# Altium schematic sheet Top Level.SchDoc
size A3; SheetNumber: 1; SheetTotal: 10
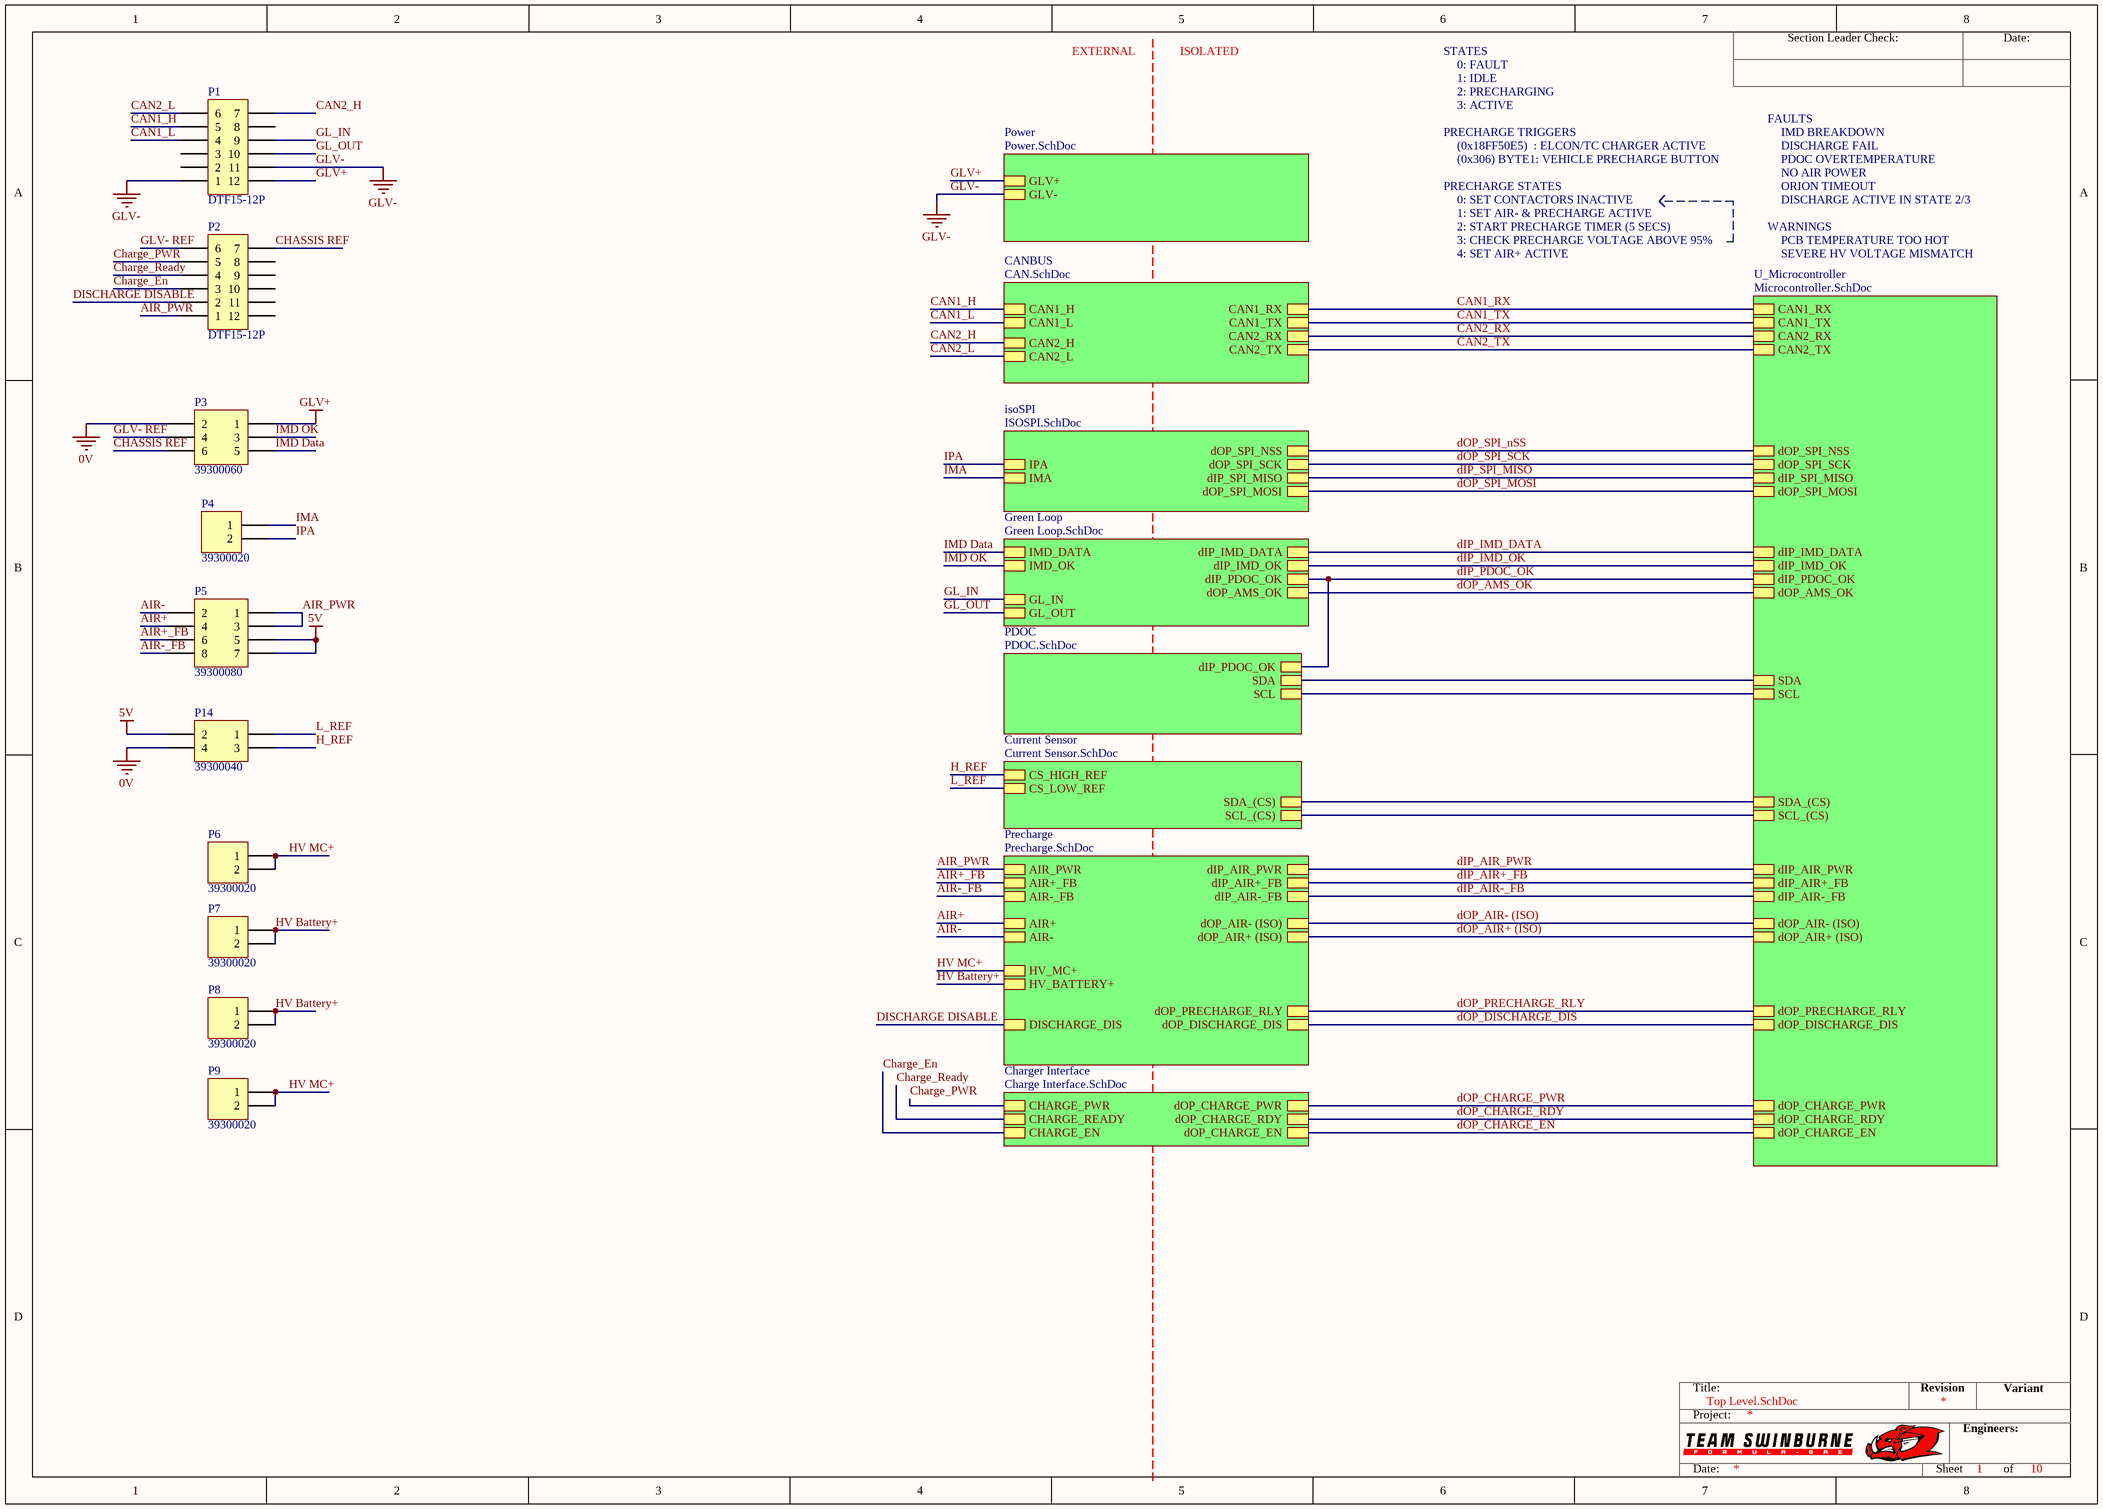
[diagram p0: Top Level.SchDoc]

## Parts
P1  DTF15-12P  [DTF15-12P]
P2  DTF15-12P  [DTF15-12P]
P3  39300060  [39300060]
P4  39300020  [39300020]
P5  39300080  [39300080]
P6  39300020  [39300020]
P7  39300020  [39300020]
P8  39300020  [39300020]
P9  39300020  [39300020]
P14  39300040  [39300040]

## Sub-sheets
CANBUS = CAN.SchDoc: CAN1_RX, CAN1_TX, CAN2_RX, CAN2_TX, CAN1_H, CAN1_L, CAN2_H, CAN2_L
Charger Interface = Charge Interface.SchDoc: dOP_CHARGE_PWR, dOP_CHARGE_RDY, dOP_CHARGE_EN, CHARGE_PWR, CHARGE_READY, CHARGE_EN
Current Sensor = Current Sensor.SchDoc: SCL_(CS), CS_HIGH_REF, CS_LOW_REF, SDA_(CS)
Green Loop = Green Loop.SchDoc: dIP_IMD_DATA, dIP_IMD_OK, dIP_PDOC_OK, dOP_AMS_OK, IMD_DATA, IMD_OK, GL_IN, GL_OUT
isoSPI = ISOSPI.SchDoc: dOP_SPI_NSS, dOP_SPI_SCK, dIP_SPI_MISO, dOP_SPI_MOSI, IPA, IMA
PDOC = PDOC.SchDoc: dIP_PDOC_OK, SDA, SCL
Power = Power.SchDoc: GLV+, GLV-
Precharge = Precharge.SchDoc: dIP_AIR_PWR, dIP_AIR+_FB, dIP_AIR-_FB, dOP_AIR- (ISO), dOP_AIR+ (ISO), dOP_PRECHARGE_RLY, dOP_DISCHARGE_DIS, DISCHARGE_DIS, AIR+, AIR-, AIR_PWR, AIR+_FB, AIR-_FB, HV_MC+, HV_BATTERY+
U_Microcontroller = Microcontroller.SchDoc: CAN1_RX, CAN1_TX, dOP_SPI_NSS, CAN2_RX, CAN2_TX, dOP_SPI_SCK, dIP_SPI_MISO, dOP_SPI_MOSI, dIP_IMD_DATA, dIP_IMD_OK, dIP_PDOC_OK, dOP_AMS_OK, dIP_AIR_PWR, dIP_AIR+_FB, dIP_AIR-_FB, dOP_AIR- (ISO), dOP_AIR+ (ISO), dOP_PRECHARGE_RLY, dOP_DISCHARGE_DIS, dOP_CHARGE_PWR, dOP_CHARGE_RDY, dOP_CHARGE_EN, SDA, SCL, SDA_(CS), SCL_(CS)

## Nets
0V: P3.2 P14.4
5V: P5.5 P5.7 P14.2
GLV+: P1.12 P3.1 ; sheet Power/GLV+
GLV-: P1.1 P1.11 ; sheet Power/GLV-
AIR+: P5.4 ; sheet Precharge/AIR+
AIR+_FB: P5.6 ; sheet Precharge/AIR+_FB
AIR-: P5.2 ; sheet Precharge/AIR-
AIR-_FB: P5.8 ; sheet Precharge/AIR-_FB
AIR_PWR: P2.1 P5.1 P5.3 ; sheet Precharge/AIR_PWR
CAN1_H: P1.5 ; sheet CANBUS/CAN1_H
CAN1_L: P1.4 ; sheet CANBUS/CAN1_L
CAN1_RX: sheet U_Microcontroller/CAN1_RX, sheet CANBUS/CAN1_RX
CAN1_TX: sheet U_Microcontroller/CAN1_TX, sheet CANBUS/CAN1_TX
CAN2_H: P1.7 ; sheet CANBUS/CAN2_H
CAN2_L: P1.6 ; sheet CANBUS/CAN2_L
CAN2_RX: sheet U_Microcontroller/CAN2_RX, sheet CANBUS/CAN2_RX
CAN2_TX: sheet U_Microcontroller/CAN2_TX, sheet CANBUS/CAN2_TX
Charge_En: P2.3 ; sheet Charger Interface/CHARGE_EN
Charge_PWR: P2.5 ; sheet Charger Interface/CHARGE_PWR
Charge_Ready: P2.4 ; sheet Charger Interface/CHARGE_READY
CHASSIS REF: P2.7 P3.6
dIP_AIR+_FB: sheet U_Microcontroller/dIP_AIR+_FB, sheet Precharge/dIP_AIR+_FB
dIP_AIR-_FB: sheet U_Microcontroller/dIP_AIR-_FB, sheet Precharge/dIP_AIR-_FB
dIP_AIR_PWR: sheet U_Microcontroller/dIP_AIR_PWR, sheet Precharge/dIP_AIR_PWR
dIP_IMD_DATA: sheet U_Microcontroller/dIP_IMD_DATA, sheet Green Loop/dIP_IMD_DATA
dIP_IMD_OK: sheet U_Microcontroller/dIP_IMD_OK, sheet Green Loop/dIP_IMD_OK
dIP_PDOC_OK: sheet U_Microcontroller/dIP_PDOC_OK, sheet Green Loop/dIP_PDOC_OK, sheet PDOC/dIP_PDOC_OK
dIP_SPI_MISO: sheet U_Microcontroller/dIP_SPI_MISO, sheet isoSPI/dIP_SPI_MISO
DISCHARGE DISABLE: P2.2 ; sheet Precharge/DISCHARGE_DIS
dOP_AIR+ (ISO): sheet U_Microcontroller/dOP_AIR+ (ISO), sheet Precharge/dOP_AIR+ (ISO)
dOP_AIR- (ISO): sheet U_Microcontroller/dOP_AIR- (ISO), sheet Precharge/dOP_AIR- (ISO)
dOP_AMS_OK: sheet U_Microcontroller/dOP_AMS_OK, sheet Green Loop/dOP_AMS_OK
dOP_CHARGE_EN: sheet U_Microcontroller/dOP_CHARGE_EN, sheet Charger Interface/dOP_CHARGE_EN
dOP_CHARGE_PWR: sheet U_Microcontroller/dOP_CHARGE_PWR, sheet Charger Interface/dOP_CHARGE_PWR
dOP_CHARGE_RDY: sheet U_Microcontroller/dOP_CHARGE_RDY, sheet Charger Interface/dOP_CHARGE_RDY
dOP_DISCHARGE_DIS: sheet U_Microcontroller/dOP_DISCHARGE_DIS, sheet Precharge/dOP_DISCHARGE_DIS
dOP_PRECHARGE_RLY: sheet U_Microcontroller/dOP_PRECHARGE_RLY, sheet Precharge/dOP_PRECHARGE_RLY
dOP_SPI_MOSI: sheet U_Microcontroller/dOP_SPI_MOSI, sheet isoSPI/dOP_SPI_MOSI
dOP_SPI_nSS: sheet U_Microcontroller/dOP_SPI_NSS, sheet isoSPI/dOP_SPI_NSS
dOP_SPI_SCK: sheet U_Microcontroller/dOP_SPI_SCK, sheet isoSPI/dOP_SPI_SCK
GL_IN: P1.9 ; sheet Green Loop/GL_IN
GL_OUT: P1.10 ; sheet Green Loop/GL_OUT
GLV- REF: P2.6 P3.4
H_REF: P14.3 ; sheet Current Sensor/CS_HIGH_REF
HV Battery+: P7.1 P7.2 P8.1 P8.2 ; sheet Precharge/HV_BATTERY+
HV MC+: P6.1 P6.2 P9.1 P9.2 ; sheet Precharge/HV_MC+
IMA: P4.1 ; sheet isoSPI/IMA
IMD Data: P3.5 ; sheet Green Loop/IMD_DATA
IMD OK: P3.3 ; sheet Green Loop/IMD_OK
IPA: P4.2 ; sheet isoSPI/IPA
L_REF: P14.1 ; sheet Current Sensor/CS_LOW_REF
(unnamed): sheet U_Microcontroller/SDA, sheet PDOC/SDA
(unnamed): sheet U_Microcontroller/SCL, sheet PDOC/SCL
(unnamed): sheet U_Microcontroller/SDA_(CS), sheet Current Sensor/SDA_(CS)
(unnamed): sheet U_Microcontroller/SCL_(CS), sheet Current Sensor/SCL_(CS)

Not connected (* = marked no-connect by the designer): P1 2 3 8; P2 8 9 10 11 12

## Notes on the sheet
- EXTERNAL
- ISOLATED
- STATES
- 0: FAULT
- 1: IDLE
- 2: PRECHARGING
- 3: ACTIVE
- PRECHARGE TRIGGERS
- (0x18FF50E5)  : ELCON/TC CHARGER ACTIVE
- (0x306) BYTE1: VEHICLE PRECHARGE BUTTON
- FAULTS
- IMD BREAKDOWN
- DISCHARGE FAIL
- PDOC OVERTEMPERATURE
- NO AIR POWER
- PRECHARGE STATES
- 1: SET AIR- & PRECHARGE ACTIVE
- 2: START PRECHARGE TIMER (5 SECS)
- 3: CHECK PRECHARGE VOLTAGE ABOVE 95%
- 0: SET CONTACTORS INACTIVE
- WARNINGS
- PCB TEMPERATURE TOO HOT
- ORION TIMEOUT
- DISCHARGE ACTIVE IN STATE 2/3
- 4: SET AIR+ ACTIVE
- SEVERE HV VOLTAGE MISMATCH
- Section Leader Check:
- Date:
- Title:
- Revision
- Variant
- Project:
- Engineers:
- Sheet
- of

## Library data of the parts
P1 P2 = DTF15-12P: Positions: 12; Pitch: 4.44mm; Row Spacing: 9.12 mm; Angle: 0; Flange: No; Contact: Copper Alloy; Part Number: DTF15-12P; Digikey Part Number: 1734-1647-ND; Digikey Link: https://www.digikey.com.au/product-detail/en/te-connectivity-deutsch-connectors/DTF15-12PA/1734-1647-ND/7220164
P3 = 39300060: Pitch: 4.2mm; Row Spacing: 5.5mm; Angle: 90; Flange: No; Contact: Tin; Part Number: 39300060; Positions: 6; Digikey Part Number: WM21353-ND
P4 P6-P9 = 39300020: Pitch: 4.2mm; Row Spacing: 5.5mm; Angle: 90; Flange: No; Contact: Tin; Part Number: 39300020; Positions: 2; Digikey Part Number: WM21351-ND
P5 = 39300080: Pitch: 4.2mm; Row Spacing: 5.5mm; Angle: 90; Flange: No; Contact: Tin; Part Number: 39300080; Positions: 8; Digikey Part Number: WM21354-ND
P14 = 39300040: Pitch: 4.2mm; Row Spacing: 5.5mm; Angle: 90; Flange: No; Contact: Tin; Part Number: 39300040; Positions: 4; Digikey Part Number: WM21352-ND